# Altium schematic sheet DS134-1.0-A色度传感器partA.SchDoc
size A4
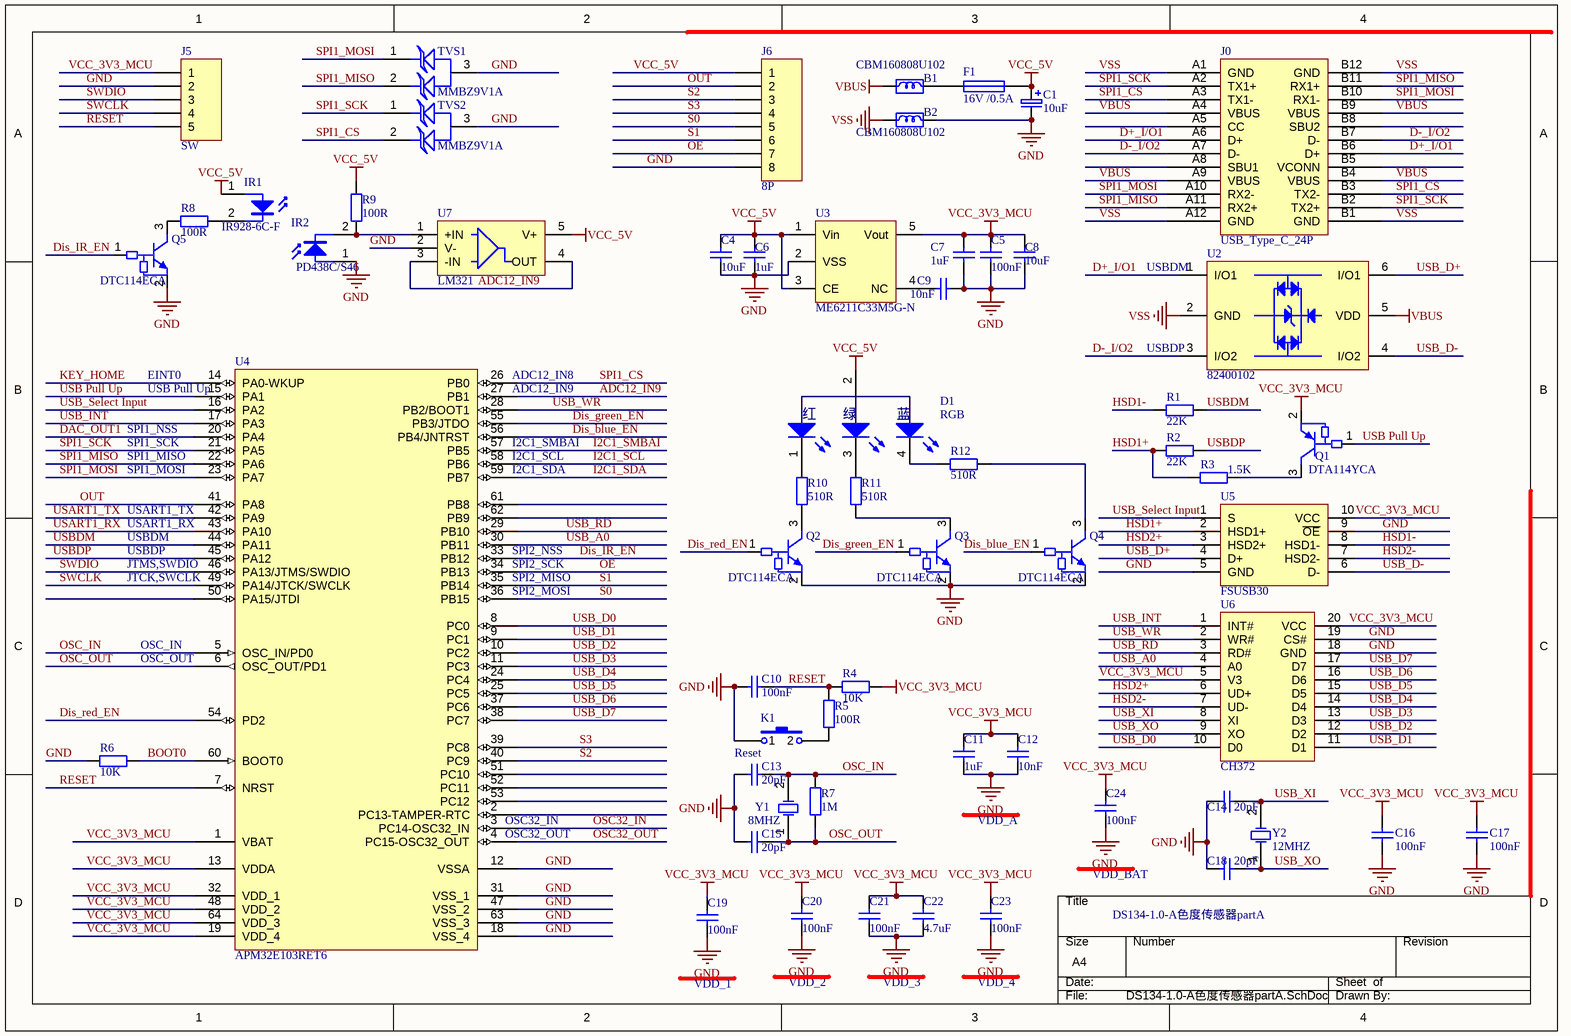
[diagram p0: DS134-1.0-A色度传感器partA.SchDoc]

## Parts
B1  CBM160808U102  [0603Bead]
B2  CBM160808U102  [0603Bead]
C1  value 10uF  [AVX_3216-18(1206)_SMD]  (hidden comment: AVX_10uF/16V ±10％(C106))
C4  value 10uF  [1206CAP]  (hidden comment: MLCC 10uF 50V ±20％ 1206)
C5  value 100nF  [0603CAP]  (hidden comment: SMDCAP00013)
C6  value 1uF  [0603CAP]  (hidden comment: SMDCAP00015)
C7  value 1uF  [0603CAP]  (hidden comment: SMDCAP00015)
C8  value 10uF  [1206CAP]  (hidden comment: MLCC 10uF 50V ±20％ 1206)
C9  value 10nF  [0603CAP]  (hidden comment: SMDCAP00010)
C10  value 100nF  [0603CAP]  (hidden comment: SMDCAP00013)
C11  value 1uF  [0603CAP]  (hidden comment: SMDCAP00015)
C12  value 10nF  [0603CAP]  (hidden comment: SMDCAP00010)
C13  value 20pF  [0603CAP]  (hidden comment: SMDCAP00002)
C14  value 20pF  [0603CAP]  (hidden comment: SMDCAP00002)
C15  value 20pF  [0603CAP]  (hidden comment: SMDCAP00002)
C16  value 100nF  [0603CAP]  (hidden comment: SMDCAP00013)
C17  value 100nF  [0603CAP]  (hidden comment: SMDCAP00013)
C18  value 20pF  [0603CAP]  (hidden comment: SMDCAP00002)
C19  value 100nF  [0603CAP]  (hidden comment: SMDCAP00013)
C20  value 100nF  [0603CAP]  (hidden comment: SMDCAP00013)
C21  value 100nF  [0603CAP]  (hidden comment: SMDCAP00013)
C22  value 4.7uF  [0603CAP]  (hidden comment: SMDCAP00012)
C23  value 100nF  [0603CAP]  (hidden comment: SMDCAP00013)
C24  value 100nF  [0603CAP]  (hidden comment: SMDCAP00013)
D1  value RGB  [LED_RGB_YANG5_W]  (hidden comment: DIPRGB00001)
F1  value 16V /0.5A  [1206FUSE]  (hidden comment: SMD1206-050C-16V)
IR1  IR928-6C-F  [IR928-6C-F]
IR2  PD438C/S46  [PD438C/S46]
J0  USB_Type_C_24P  [USB_TYPE_C_24P_Receptacle]
J5  value SW  [H5]  (hidden comment: DIP5 单排直针  间距2mm 针长11mm 铜)
J6  value 8P  [SIP8]  (hidden comment: SL000000042)
K1  value Reset  [KEY_TS-1185-x-A-A-A]  (hidden comment: TS-1185-B-A-A-A)
Q1  value DTA114YCA  [SOT23]  (hidden comment: DTA114YCA SOT-23 长电)
Q2  value DTC114ECA  [SOT23]  (hidden comment: SMDIC000037)
Q3  value DTC114ECA  [SOT23]  (hidden comment: SMDIC000037)
Q4  value DTC114ECA  [SOT23]  (hidden comment: SMDIC000037)
Q5  value DTC114ECA  [SOT23]  (hidden comment: SMDIC000037)
R1  value 22K  [0603RES]  (hidden comment: SMDRES00108)
R2  value 22K  [0603RES]  (hidden comment: SMDRES00108)
R3  value 1.5K  [0603RES]  (hidden comment: SMDRES00039)
R4  value 10K  [0603RES]  (hidden comment: SMDRES00056)
R5  value 100R  [0603RES]  (hidden comment: SMDRES00015)
R6  value 10K  [0603RES]  (hidden comment: SMDRES00056)
R7  value 1M  [0603RES]
R8  value 100R  [0603RES]  (hidden comment: SMDRES00015)
R9  value 100R  [0603RES]  (hidden comment: SMDRES00015)
R10  value 510R  [0603RES]  (hidden comment: SMDRES00030)
R11  value 510R  [0603RES]  (hidden comment: SMDRES00030)
R12  value 510R  [0603RES]  (hidden comment: SMDRES00030)
TVS1  MMBZ9V1A  [SOT23]
TVS2  MMBZ9V1A  [SOT23]
U2  82400102  [SOT23-6]
U3  ME6211C33M5G-N  [SOT23-5]
U4  APM32E103RET6  [LQFP64_N]
U5  FSUSB30  [msop10]
U6  CH372  [SSOP20]
U7  value LM321  [SOT23-5]  (hidden comment: SMDIC000035)
Y1  value 8MHZ  [XTAL_SMD5032_2P]  (hidden comment: 8.00000 MHz 20PF -/+10PPM)
Y2  value 12MHZ  [XTAL_SMD5032_2P]  (hidden comment: 12.00000 MHz 20PF -/+10PPM)

## Nets
GND: B2.2 C1.2 C4.1 C5.1 C6.1 C7.1 C8.1 C9.2 C10.1 C11.1 C12.1 C13.1 C14.1 C15.1 C16.1 C17.1 C18.1 C19.1 C20.1 C21.1 C22.1 C23.1 C24.1 IR2.1(K) J5.2 J6.8 K1.1 Q2.2(GND) Q3.2(GND) Q4.2(GND) Q5.2(GND) R6.2 TVS1.3 TVS2.3 U3.2(VSS) U4.12(VSSA) U4.18(VSS_4) U4.31(VSS_1) U4.47(VSS_2) U4.63(VSS_3) U5.5(GND) U5.9(~{OE}) U6.18(GND) U6.19(CS#) U7.2(V-)
VBUS: B1.1 J0.A4(VBUS) J0.A9(VBUS) J0.B4(VBUS) J0.B9(VBUS) U2.5(VDD)
VCC_3V3_MCU: C5.2 C7.2 C8.2 C11.2 C12.2 C16.2 C17.2 C19.2 C20.2 C21.2 C22.2 C23.2 C24.2 J5.1 Q1.2(GND) R4.2 U3.5(Vout) U4.1(VBAT) U4.13(VDDA) U4.19(VDD_4) U4.32(VDD_1) U4.48(VDD_2) U4.64(VDD_3) U5.10(VCC) U6.5(V3) U6.20(VCC)
VCC_5V: C1.1 C4.2 C6.2 D1.2 F1.2 IR1.1(K) J6.1 R9.2 U3.1(Vin) U3.3(CE) U7.5(V+)
VSS: B2.1 J0.A1(GND) J0.A12(GND) J0.B1(GND) J0.B12(GND) U2.2(GND)
ADC12_IN9: U4.27(PB1) U7.3(-IN) U7.4(OUT)
BOOT0: R6.1 U4.60(BOOT0)
D+_I/O1: J0.A6(D+) J0.B6(D+) U2.1(I/O1)
D-_I/O2: J0.A7(D-) J0.B7(D-) U2.3(I/O2)
DAC_OUT1: U4.20(PA4)
Dis_blue_EN: Q4.1(IN) U4.56(PB4/JNTRST)
Dis_green_EN: Q3.1(IN) U4.55(PB3/JTDO)
Dis_IR_EN: Q5.1(IN) U4.33(PB12)
Dis_red_EN: Q2.1(IN) U4.54(PD2)
HSD1+: R2.1 R3.1 U5.2(HSD1+)
HSD1-: R1.1 U5.8(HSD1-)
HSD2+: U5.3(HSD2+) U6.6(UD+)
HSD2-: U5.7(HSD2-) U6.7(UD-)
I2C1_SCL: U4.58(PB6)
I2C1_SDA: U4.59(PB7)
I2C1_SMBAI: U4.57(PB5)
KEY_HOME: U4.14(PA0-WKUP)
OE: J6.7 U4.34(PB13)
OSC32_IN: U4.3(PC14-OSC32_IN)
OSC32_OUT: U4.4(PC15-OSC32_OUT)
OSC_IN: C13.2 R7.2 U4.5(OSC_IN/PD0) Y1.2(OSC2)
OSC_OUT: C15.2 R7.1 U4.6(OSC_OUT/PD1) Y1.1(OSC1)
OUT: J6.2 U4.41(PA8)
RESET: C10.2 J5.5 R4.1 R5.2 U4.7(NRST)
S0: J6.5 U4.36(PB15)
S1: J6.6 U4.35(PB14)
S2: J6.3 U4.40(PC9)
S3: J6.4 U4.39(PC8)
SPI1_CS: J0.A3(TX1-) J0.B3(TX2-) TVS2.2 U4.26(PB0)
SPI1_MISO: J0.A11(RX2+) J0.B11(RX1+) TVS1.2 U4.22(PA6)
SPI1_MOSI: J0.A10(RX2-) J0.B10(RX1-) TVS1.1 U4.23(PA7)
SPI1_SCK: J0.A2(TX1+) J0.B2(TX2+) TVS2.1 U4.21(PA5)
SWCLK: J5.4 U4.49(PA14/JTCK/SWCLK)
SWDIO: J5.3 U4.46(PA13/JTMS/SWDIO)
USART1_RX: U4.43(PA10)
USART1_TX: U4.42(PA9)
USB Pull Up: Q1.1(IN) U4.15(PA1)
USB_A0: U4.30(PB11) U6.4(A0)
USB_D0: U4.8(PC0) U6.10(D0)
USB_D1: U4.9(PC1) U6.11(D1)
USB_D2: U4.10(PC2) U6.12(D2)
USB_D3: U4.11(PC3) U6.13(D3)
USB_D4: U4.24(PC4) U6.14(D4)
USB_D5: U4.25(PC5) U6.15(D5)
USB_D6: U4.37(PC6) U6.16(D6)
USB_D7: U4.38(PC7) U6.17(D7)
USB_D+: U2.6(I/O1) U5.4(D+)
USB_D-: U2.4(I/O2) U5.6(D-)
USB_INT: U4.17(PA3) U6.1(INT#)
USB_RD: U4.29(PB10) U6.3(RD#)
USB_Select Input: U4.16(PA2) U5.1(S)
USB_WR: U4.28(PB2/BOOT1) U6.2(WR#)
USB_XI: C14.2 U6.8(XI) Y2.2(OSC2)
USB_XO: C18.2 U6.9(XO) Y2.1(OSC1)
USBDM: R1.2 U4.44(PA11)
USBDP: R2.2 U4.45(PA12)
NetB1_2: B1.2 F1.1
NetC9_1: C9.1 U3.4(NC)
NetD1_1: D1.1 R10.2
NetD1_3: D1.3 R11.2
NetD1_4: D1.4 R12.1
NetIR1_2: IR1.2(A) R8.2
NetIR2_2: IR2.2(A) R9.1 U7.1(+IN)
NetK1_2: K1.2 R5.1
NetQ1_3: Q1.3(OUT) R3.2
NetQ2_3: Q2.3(OUT) R10.1
NetQ3_3: Q3.3(OUT) R11.1
NetQ4_3: Q4.3(OUT) R12.2
NetQ5_3: Q5.3(OUT) R8.1

Not connected (* = marked no-connect by the designer): J0 A5(CC) A8(SBU1) B5(VCONN) B8(SBU2); U4 2(PC13-TAMPER-RTC) 50(PA15/JTDI) 51(PC10) 52(PC11) 53(PC12) 61(PB8) 62(PB9)

## Notes on the sheet
- (near U2) USBDM
- EINT0
- (near U4) ADC12_IN8
- (near U2) USBDP
- SPI1_SCK
- SPI1_NSS
- (near U4) USB Pull Up
- (near U4) ADC12_IN9
- (near U4) I2C1_SMBAI
- (near U4) SPI1_MISO
- (near U4) SPI1_MOSI
- (near U4) USART1_TX
- (near U4) I2C1_SCL
- (near U4) I2C1_SDA
- (near U4) JTMS,SWDIO
- (near U4) JTCK,SWCLK
- USBDM
- USBDP
- (near U4) USART1_RX
- (near U4) SPI2_MISO
- (near U4) SPI2_SCK
- (near U4) SPI2_NSS
- OSC_IN
- (near U4) SPI2_MOSI
- (near U4) OSC_OUT
- (near U4) OSC32_IN
- (near U4) OSC32_OUT
- VDD_A
- VDD_BAT
- (near C18) DS134-1.0-A色度传感器partA
- VDD_1
- VDD_2
- VDD_3
- VDD_4
- DWG. NO.
- REV.
- SHT.
- THIS DOCUMENT AND THE DATA DISCLOSED HEREIN OR HEREWITH IS THE PROPERTY OF ALTIUM LIMITED AND MAY BE FREELY DISTRIBUTED IN WHOLE. NO RIGHTS ARE RESERVED OR EXPRESS OR IMPLIED WARANTEE GIVEN.
- REVISION
- DESCRIPTION
- DATE
- APPROVED
- ENG:
- APPROVALS
- PROJECT
- DSN:
- CHK:
- REFERENCE DOCUMENTS
- PROJECT REVISION:
- TITLE
- DOCUMENT REVISION:
- DESIGN ITEM:
- BOM:
- FAB DWG:
- PCB DWG:
- ASSY DWG:
- SCALE:
- SIZE
- B
- CAGE CODE
- FILE NAME
- DWG NO.
- SHEET
- OF
- REV
- (in symbol Φ5 RGB 透明 共阳 DIP4) 红; 绿; 蓝

## Library data of the parts
B1 B2 = Chip Ferrite Bead 0606: 贴片磁珠
C1 = AVX_10uF/16V ±10％(C106): 钽电容
C4 C8 = MLCC 10uF 50V ±20％ 1206: 贴片电容
C5 C10 C16 C17 C19-C21 C23 C24 = MLCC 100nF 50V ±10％ 0603: 贴片电容
C6 C7 C11 = MLCC 1uF 50V ±10％ 0603: 贴片电容
C9 C12 = MLCC 10nF 50V ±10％ 0603: 贴片电容
C13-C15 C18 = MLCC 20pF 50V ±10％ 0603: 贴片电容
C22 = MLCC 4.7uF 50V ±10％ 0603: 贴片电容
D1 = Φ5 RGB 透明 共阳 DIP4: RGB插件LED
F1 = SMD1206-050C-16V: 贴片自恢复保险丝 16V /0.5A
J5 = DIP5 单排直针  间距2mm 针长11mm 铜: 单排直针
J6 = DIP8 单排直针 1*40P 间距2.54mm 针长11mm 铜: 单排直针
K1 = TS-1185-B-A-A-A: 轻触开关
Q1 = DTA114YCA SOT-23 长电: 数字晶体管
Q2-Q5 = DTC114ECA SOT-23 长电: 数字晶体管
R1 R2 = Chip 22K 1/16W ±1％ 0603: 贴片电阻
R3 = Chip 1.5K 1/16W ±1％ 0603: 贴片电阻
R4 R6 = Chip 10K 1/16W ±1％ 0603: 贴片电阻
R5 R8 R9 = Chip 100R 1/16W ±1％ 0603: 贴片电阻
R7 = Chip 1M 1/16W ±1％ 0603: 贴片电阻
R10-R12 = Chip 510R 1/16W ±1％ 0603: 贴片电阻
TVS1 TVS2 = TVS: 瞬态抑制二极管
U2 = 82400102: 瞬态抑制二极管(TVS)
U3 = ME6211C33M5G-N: 稳压芯片
U5 = FSUSB30: USB 开关芯片
U7 = LM321 SOT23-5: 运放芯片
Y1 = X50328MSB2GI: 贴片晶振
Y2 = X503212MSB2GI: 贴片晶振